# EAGLE schematic riser-extender (EAGLE 7.7.0)
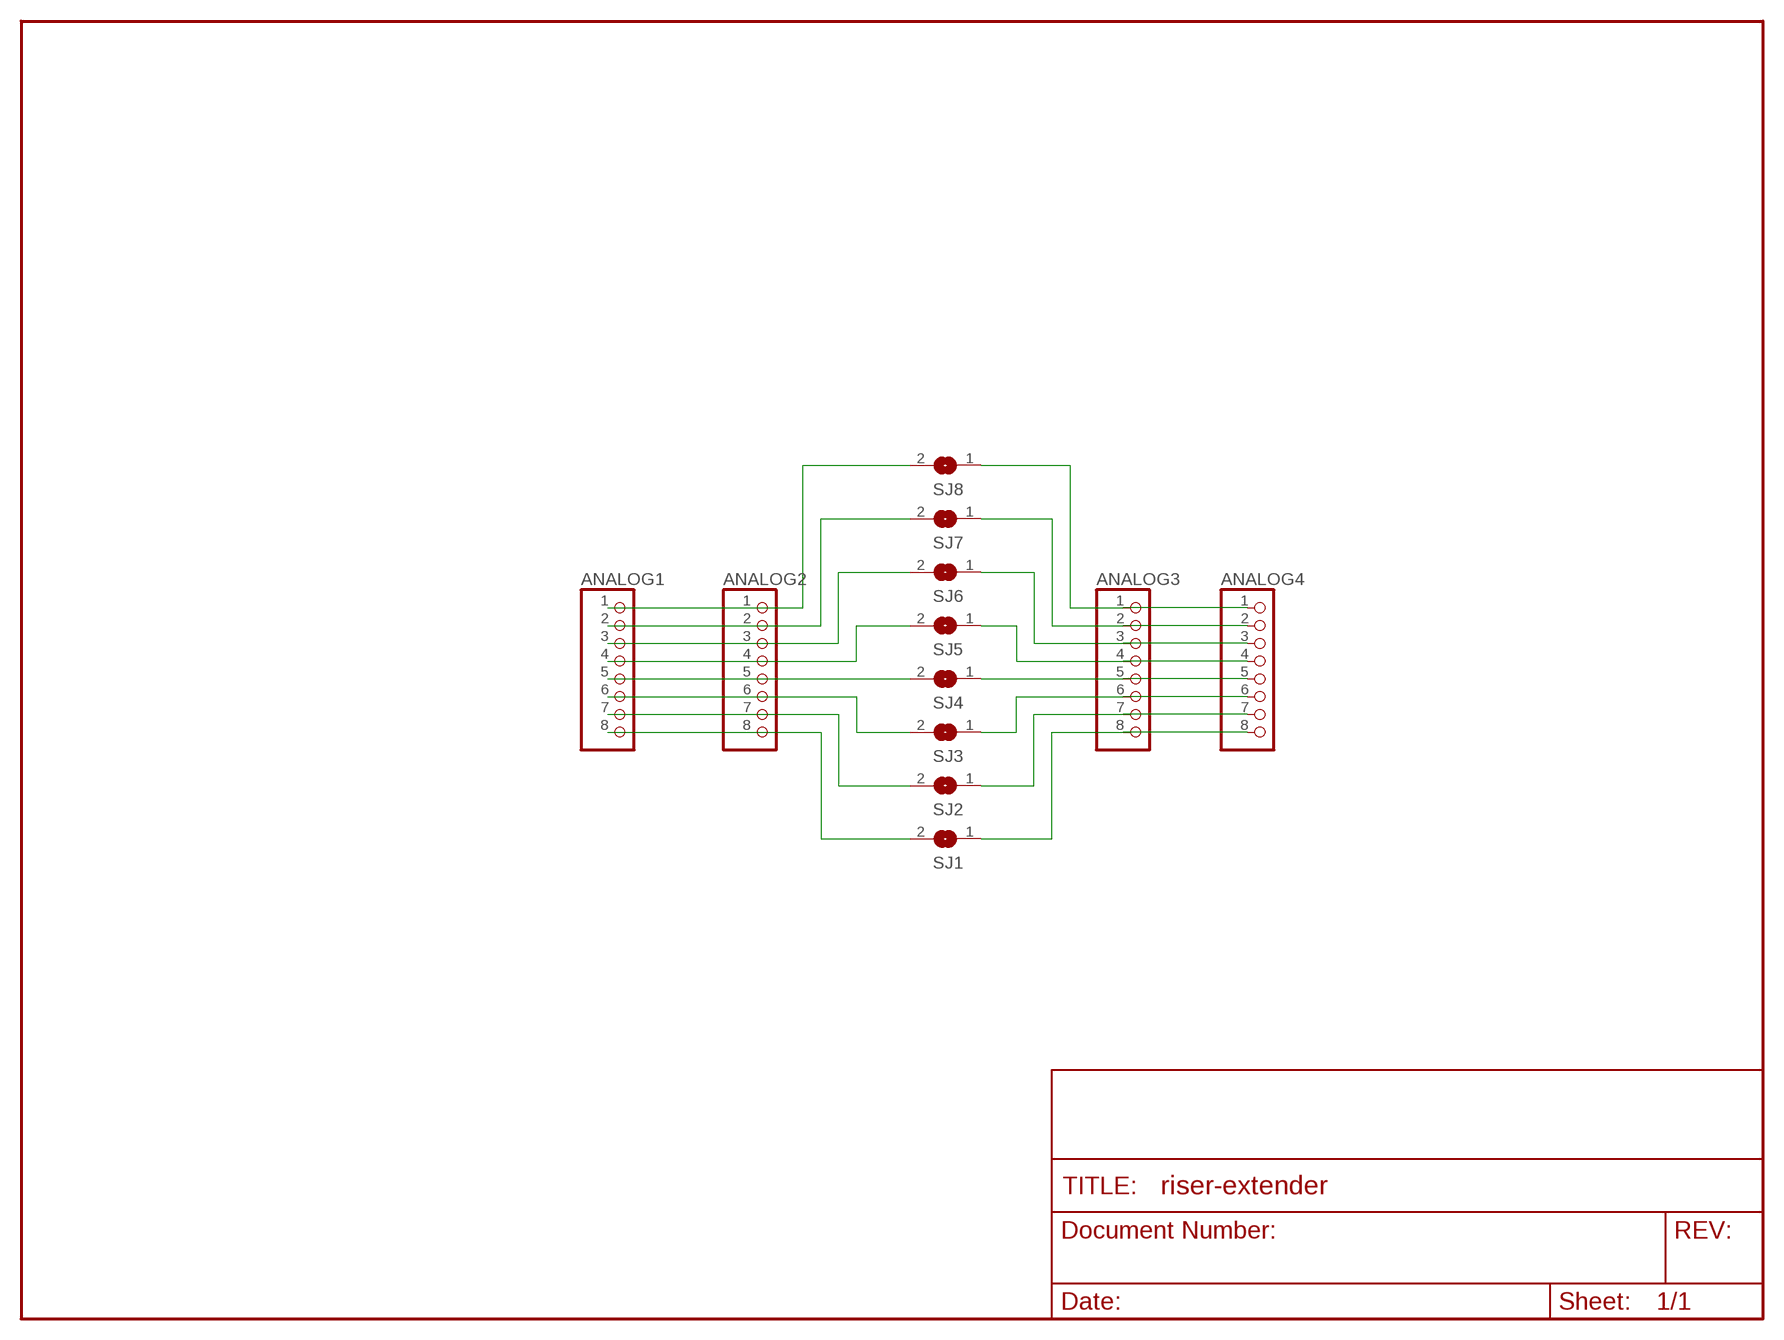
[diagram p0: schematic, sheet 1]

## Parts
ANALOG1  PINHD-1X8  [1X08]
ANALOG2  PINHD-1X8  [1X08]
ANALOG3  PINHD-1X8  [1X08]
ANALOG4  PINHD-1X8  [1X08]
SJ1  SJ  [SJ]
SJ2  SJ  [SJ]
SJ3  SJ  [SJ]
SJ4  SJ  [SJ]
SJ5  SJ  [SJ]
SJ6  SJ  [SJ]
SJ7  SJ  [SJ]
SJ8  SJ  [SJ]

## Nets
N$1: ANALOG1.1 ANALOG2.1 SJ8.2
N$2: ANALOG1.2 ANALOG2.2 SJ7.2
N$3: ANALOG1.3 ANALOG2.3 SJ6.2
N$4: ANALOG1.4 ANALOG2.4 SJ5.2
N$5: ANALOG1.5 ANALOG2.5 SJ4.2
N$6: ANALOG1.6 ANALOG2.6 SJ3.2
N$7: ANALOG1.7 ANALOG2.7 SJ2.2
N$8: ANALOG1.8 ANALOG2.8 SJ1.2
N$9: ANALOG3.5 ANALOG4.5 SJ4.1
N$10: ANALOG3.6 ANALOG4.6 SJ3.1
N$11: ANALOG3.7 ANALOG4.7 SJ2.1
N$12: ANALOG3.8 ANALOG4.8 SJ1.1
N$13: ANALOG3.4 ANALOG4.4 SJ5.1
N$14: ANALOG3.3 ANALOG4.3 SJ6.1
N$15: ANALOG3.2 ANALOG4.2 SJ7.1
N$16: ANALOG3.1 ANALOG4.1 SJ8.1

## Library data of the parts
ANALOG1-ANALOG4 = pinhead:PINHD-1X8: PIN HEADER
SJ1-SJ8 = jumper:SJ: SMD solder JUMPER